# Altium schematic sheet MCU.SchDoc
size A4; SheetNumber: 7; SheetTotal: 13
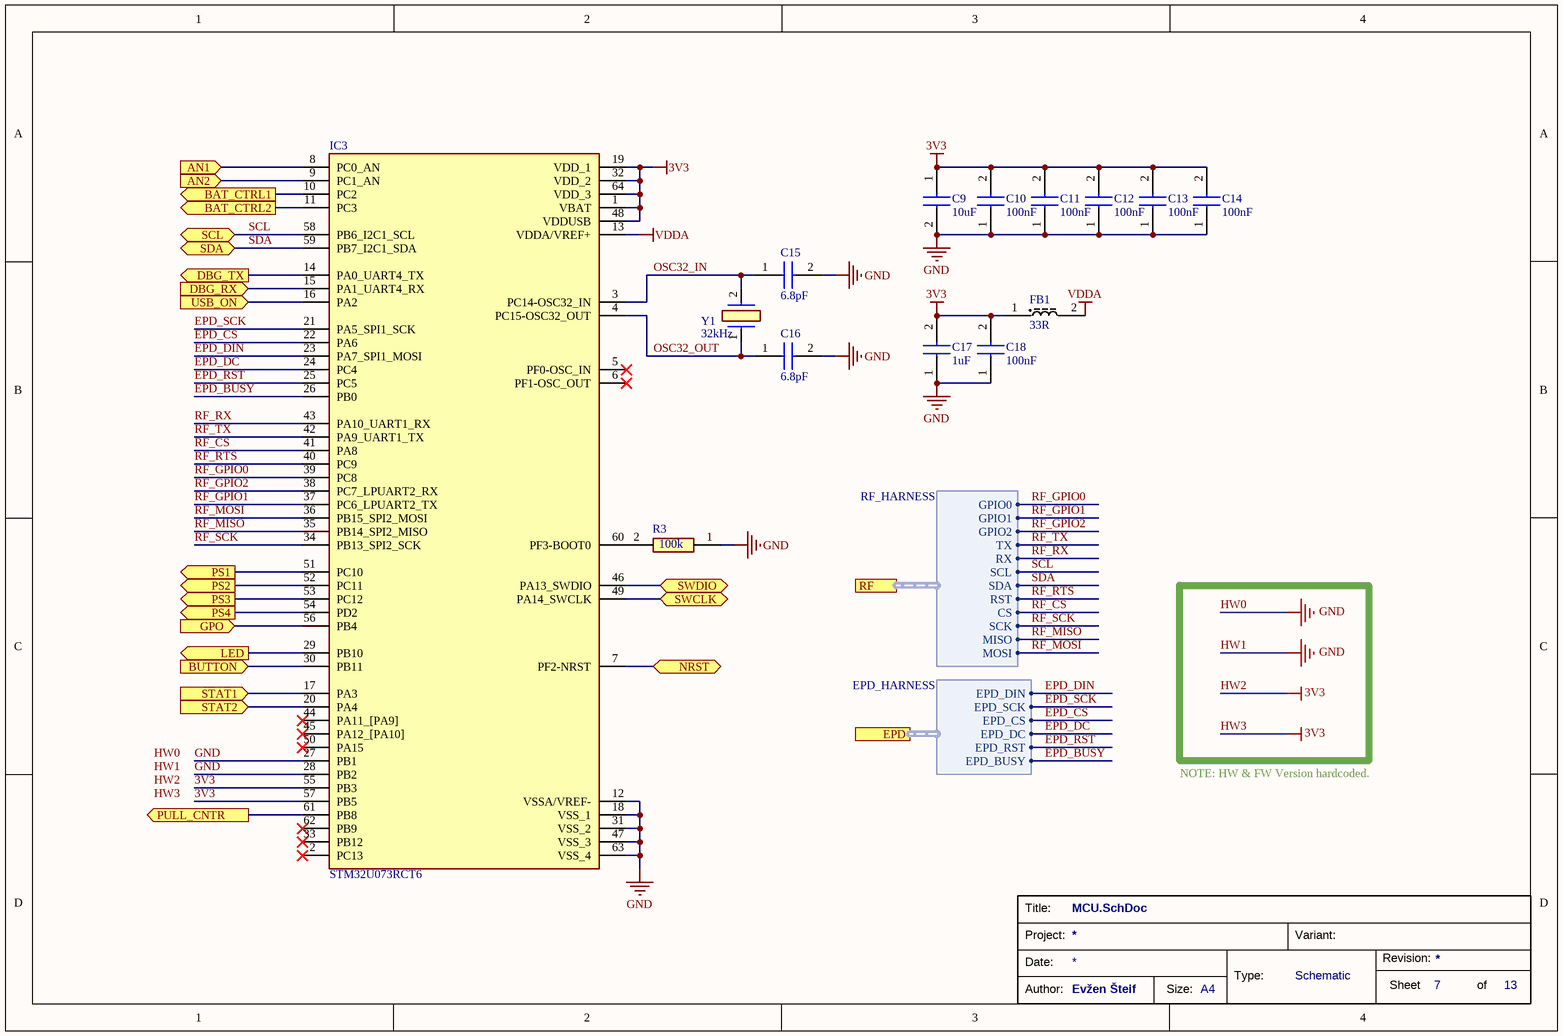
[diagram p0: MCU.SchDoc]

## Parts
C9  10uF  [GRM18x]
C10  100nF  [CAPC1005X70N]
C11  100nF  [CAPC1005X70N]
C12  100nF  [CAPC1005X70N]
C13  100nF  [CAPC1005X70N]
C14  100nF  [CAPC1005X70N]
C15  6.8pF  [GCM155]
C16  6.8pF  [GCM155]
C17  1uF  [CAPC1608X90N]
C18  100nF  [CAPC1005X70N]
FB1  33R  [BLM18SP221SN1B]
IC3  STM32U073RCT6  [QFP50P1200X1200X160-64N]
R3  100k  [RESC1005X35N]
Y1  32kHz  [ECS32712534RRTR]

## Ports
AN1 (in, see main[2B]), AN2 (in, see main[2B]), BAT_CTRL1 (out, see main[2B]), BAT_CTRL2 (out, see main[2B]), BUTTON (in, see main[2C]), DBG_RX (in, see main[3C]), DBG_TX (out, see main[3C]), EPD (harness EPD_HARNESS, see main[3C], EInkHeader[4B]), GPO (in, see main[3B], NFC[2C]), LED (out, see main[2C]), NRST (bidir, see main[2C]), PS1 (out, see main[2B], Power[3C]), PS2 (out, see main[2B], Power[3C]), PS3 (out, see main[2B], Power[3C]), PS4 (out, see main[2B], Power[3C]), PULL_CNTR (out, see main[3B]), RF (harness RF_HARNESS, see main[3C], RFHeader[2B]), SCL (bidir, see main[3B]), SDA (bidir, see main[3B]), STAT1 (in, see main[2B]), STAT2 (in, see main[2B]), SWCLK (bidir, see main[2C]), SWDIO (bidir, see main[2C]), USB_ON (in, see main[3C], USBtoUART[3C])

## Harnesses
RF_HARNESS: GPIO1, GPIO2, TX, RX, SCL, SDA, GPIO0, RST, CS, SCK, MISO, MOSI
EPD_HARNESS: EPD_DIN, EPD_SCK, EPD_CS, EPD_DC, EPD_RST, EPD_BUSY

## Nets
3V3: C9.1 C10.2 C11.2 C12.2 C13.2 C14.2 C17.2 C18.2 FB1.1 IC3.1(VBAT) IC3.19(VDD_1) IC3.32(VDD_2) IC3.48(VDDUSB) IC3.55(PB3) IC3.57(PB5) IC3.64(VDD_3)
GND: C9.2 C10.1 C11.1 C12.1 C13.1 C14.1 C15.2 C16.2 C17.1 C18.1 IC3.12(VSSA/VREF-) IC3.18(VSS_1) IC3.27(PB1) IC3.28(PB2) IC3.31(VSS_2) IC3.47(VSS_3) IC3.63(VSS_4) R3.1
VDDA: FB1.2 IC3.13(VDDA/VREF+)
AN1: IC3.8(PC0_AN) ; port AN1
AN2: IC3.9(PC1_AN) ; port AN2
BAT_CTRL1: IC3.10(PC2) ; port BAT_CTRL1
BAT_CTRL2: IC3.11(PC3) ; port BAT_CTRL2
BUTTON: IC3.30(PB11) ; port BUTTON
DBG_RX: IC3.15(PA1_UART4_RX) ; port DBG_RX
DBG_TX: IC3.14(PA0_UART4_TX) ; port DBG_TX
EPD_BUSY: IC3.26(PB0) ; port EPD.EPD_BUSY
EPD_CS: IC3.22(PA6) ; port EPD.EPD_CS
EPD_DC: IC3.24(PC4) ; port EPD.EPD_DC
EPD_DIN: IC3.23(PA7_SPI1_MOSI) ; port EPD.EPD_DIN
EPD_RST: IC3.25(PC5) ; port EPD.EPD_RST
EPD_SCK: IC3.21(PA5_SPI1_SCK) ; port EPD.EPD_SCK
GPO: IC3.56(PB4) ; port GPO
LED: IC3.29(PB10) ; port LED
NRST: IC3.7(PF2-NRST) ; port NRST
OSC32_IN: C15.1 IC3.3(PC14-OSC32_IN) Y1.2
OSC32_OUT: C16.1 IC3.4(PC15-OSC32_OUT) Y1.1
PS1: IC3.51(PC10) ; port PS1
PS2: IC3.52(PC11) ; port PS2
PS3: IC3.53(PC12) ; port PS3
PS4: IC3.54(PD2) ; port PS4
PULL_CNTR: IC3.61(PB8) ; port PULL_CNTR
RF_CS: IC3.41(PA8) ; port RF.CS
RF_GPIO0: IC3.39(PC8) ; port RF.GPIO0
RF_GPIO1: IC3.37(PC6_LPUART2_TX) ; port RF.GPIO1
RF_GPIO2: IC3.38(PC7_LPUART2_RX) ; port RF.GPIO2
RF_MISO: IC3.35(PB14_SPI2_MISO) ; port RF.MISO
RF_MOSI: IC3.36(PB15_SPI2_MOSI) ; port RF.MOSI
RF_RTS: IC3.40(PC9) ; port RF.RST
RF_RX: IC3.43(PA10_UART1_RX) ; port RF.RX
RF_SCK: IC3.34(PB13_SPI2_SCK) ; port RF.SCK
RF_TX: IC3.42(PA9_UART1_TX) ; port RF.TX
SCL: IC3.58(PB6_I2C1_SCL) ; port SCL, port RF.SCL
SDA: IC3.59(PB7_I2C1_SDA) ; port SDA, port RF.SDA
STAT1: IC3.17(PA3) ; port STAT1
STAT2: IC3.20(PA4) ; port STAT2
SWCLK: IC3.49(PA14_SWCLK) ; port SWCLK
SWDIO: IC3.46(PA13_SWDIO) ; port SWDIO
USB_ON: IC3.16(PA2) ; port USB_ON
NetIC3_60: IC3.60(PF3-BOOT0) R3.2

Not connected (* = marked no-connect by the designer): IC3 2(PC13)* 5(PF0-OSC_IN)* 6(PF1-OSC_OUT)* 33(PB12)* 44(PA11_[PA9])* 45(PA12_[PA10])* 50(PA15)* 62(PB9)*

## Notes on the sheet
- HW0
- HW1
- GND
- HW2
- 3V3
- NOTE: HW & FW Version hardcoded.
- HW3
- Title:
- Date:
- Project:
- Type:
- Schematic
- Variant:
- Revision:
- Sheet
- of
- Author:
- Evžen Šteif
- Size:
- A4

## Library data of the parts
C9 = GRM188R61E106KA73D: Capacitor; Manufacturer_Name: Murata Electronics; Datasheet Link: https://search.murata.co.jp/Ceramy/image/img/A01X/G101/ENG/GRM188R61E106KA73-01A.pdf; Height: 0.9mm; Manufacturer_Part_Number: GRM188R61E106KA73D; Mouser Part Number: 81-GRM188R61E106KA3D; Mouser Price/Stock: https://www.mouser.co.uk/ProductDetail/Murata-Electronics/GRM188R61E106KA73D?qs=5aG0NVq1C4z8ebxPkQZf9A%3D%3D; Arrow Part Number: GRM188R61E106KA73D; Arrow Price/Stock: https://www.arrow.com/en/products/grm188r61e106ka73d/murata-manufacturing?region=nac
C10-C14 C18 = GRM155R61A104KA01D: Capacitor; Manufacturer_Name: Murata Electronics; Datasheet Link: https://search.murata.co.jp/Ceramy/image/img/A01X/G101/ENG/GRM155R61A104KA01-02A.pdf; Height: 0.7mm; Manufacturer_Part_Number: GRM155R61A104KA01D; Mouser Part Number: 81-GRM155R61A104KA01; Mouser Price/Stock: https://www.mouser.co.uk/ProductDetail/Murata-Electronics/GRM155R61A104KA01D?qs=5bAuhL3RhmNZw0v59AqOJA%3D%3D; Arrow Part Number: GRM155R61A104KA01D; Arrow Price/Stock: https://www.arrow.com/en/products/grm155r61a104ka01d/murata-manufacturing?utm_currency=USD&region=europe
C15 C16 = GCM1555C1H6R8BA16J: Capacitor; Manufacturer_Name: Murata Electronics; Datasheet Link: https://search.murata.co.jp/Ceramy/image/img/A01X/G101/ENG/GCM1555C1H6R8BA16-01A.pdf; Height: 0.55mm; Manufacturer_Part_Number: GCM1555C1H6R8BA16J; Mouser Part Number: 81-GCM1555C1H6R8BA6J; Mouser Price/Stock: https://www.mouser.co.uk/ProductDetail/Murata-Electronics/GCM1555C1H6R8BA16J?qs=QzBtWTOodeUHvskaC%252BV70A%3D%3D
C17 = GRM188R61A105KA61D: Capacitor; Manufacturer_Name: Murata Electronics; Datasheet Link: https://search.murata.co.jp/Ceramy/image/img/A01X/G101/ENG/GRM188R61A105KA61-01A.pdf; Height: 0.9mm; Manufacturer_Part_Number: GRM188R61A105KA61D; Mouser Part Number: 81-GRM39R105K10; Mouser Price/Stock: https://www.mouser.co.uk/ProductDetail/Murata-Electronics/GRM188R61A105KA61D?qs=LlFn95tWfDgsujID1PD8Jw%3D%3D; Arrow Part Number: GRM188R61A105KA61D; Arrow Price/Stock: https://www.arrow.com/en/products/grm188r61a105ka61d/murata-manufacturing?region=nac
FB1 = BLM18SG330SN1D: Ferrite Bead; Manufacturer_Name: Murata Electronics; Datasheet Link: http://www.murata.com/~/media/webrenewal/support/library/catalog/products/emc/emifil/c31e.ashx?la=en-gb; Height: 0.95mm; Manufacturer_Part_Number: BLM18SG330SN1D; Mouser Part Number: 81-BLM18SG330SN1D; Mouser Price/Stock: https://www.mouser.co.uk/ProductDetail/Murata-Electronics/BLM18SG330SN1D?qs=7EBvPakHacUT88safgvlfQ%3D%3D; Arrow Part Number: BLM18SG330SN1D; Arrow Price/Stock: https://www.arrow.com/en/products/blm18sg330sn1d/murata-manufacturing
IC3 = STM32U073RCT6: Integrated Circuit; Manufacturer_Name: STMicroelectronics; Datasheet Link: https://www.st.com/resource/en/datasheet/stm32u073cc.pdf; Height: 1.6mm; Manufacturer_Part_Number: STM32U073RCT6
R3 = RT0402FRE07100KL: Resistor; Manufacturer_Name: KEMET; Datasheet Link: https://www.yageo.com/upload/media/product/productsearch/datasheet/rchip/PYu-RT_1-to-0.01_RoHS_L_11.pdf; Height: 0.35mm; Manufacturer_Part_Number: RT0402FRE07100KL; Mouser Part Number: 603-RT0402FRE07100KL; Mouser Price/Stock: https://www.mouser.co.uk/ProductDetail/YAGEO/RT0402FRE07100KL?qs=BXCcY9r%252B08CxTvf5JB1kiw%3D%3D; Arrow Part Number: RT0402FRE07100KL; Arrow Price/Stock: https://www.arrow.com/en/products/rt0402fre07100kl/yageo
Y1 = ECS-.327-6-34RR-TR: Crystal or Oscillator; Manufacturer_Name: ECS; Datasheet Link: https://ecsxtal.com/store/pdf/ECX-34RR.pdf; Height: 0mm; Manufacturer_Part_Number: ECS-.327-6-34RR-TR; Mouser Part Number: 520-.327-6-34RRT; Mouser Price/Stock: https://www.mouser.co.uk/ProductDetail/ECS/ECS-.327-6-34RR-TR?qs=Mv7BduZupUhhqbPNycFzzw%3D%3D; Arrow Part Number: ECS-.327-6-34RR-TR; Arrow Price/Stock: https://www.arrow.com/en/products/ecs-.327-6-34rr-tr/ecs-international?region=nac